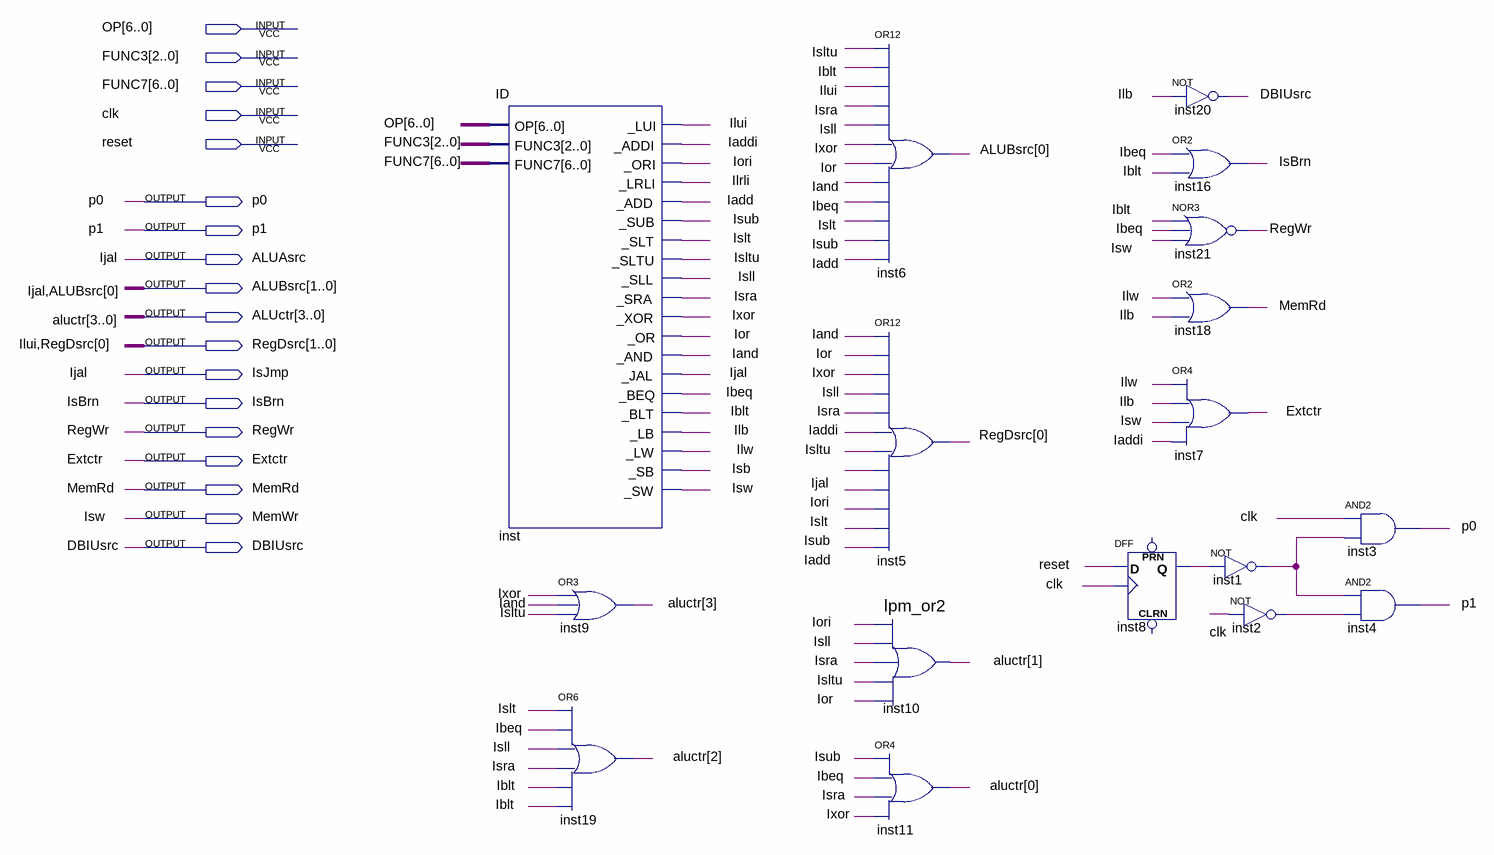
[diagram p0: schematic sheet]
// Quartus schematic CU.bdf as structural Verilog: 17 symbols, 18 pins
module CU (
  input  [6:0] OP,
  input  [2:0] FUNC3,
  input  [6:0] FUNC7,
  input  clk,
  input  reset,
  output p0,
  output p1,
  output ALUAsrc,
  output [1:0] ALUBsrc,
  output [3:0] ALUctr,
  output [1:0] RegDsrc,
  output IsJmp,
  output IsBrn,
  output RegWr,
  output Extctr,
  output MemRd,
  output MemWr,
  output DBIUsrc
);

  wire Iadd, Iaddi, Iand, Ibeq, Iblt, Ilb, Ilrli, Ilw, inst1_out, inst2_out, inst8_q, Ior, Iori, Isb, Isll,
       Islt, Isltu, Isra, Isub, Ixor;

  ID inst (
    .OP(OP), .FUNC3(FUNC3), .FUNC7(FUNC7), ._LUI(RegDsrc[1]), ._ADDI(Iaddi), ._ORI(Iori), ._LRLI(Ilrli),
    ._ADD(Iadd), ._SUB(Isub), ._SLT(Islt), ._SLTU(Isltu), ._SLL(Isll), ._SRA(Isra), ._XOR(Ixor), ._OR(Ior),
    ._AND(Iand), ._JAL(ALUAsrc), ._BEQ(Ibeq), ._BLT(Iblt), ._LB(Ilb), ._LW(Ilw), ._SB(Isb), ._SW(MemWr));
  or inst9 (ALUctr[3], Ixor, Iand, Isltu);
  or inst19 (ALUctr[2], Islt, Ibeq, Isll, Isra, Iblt, Iblt);
  or inst6 (ALUBsrc[0], Isltu, Iblt, RegDsrc[1], Isra, Isll, Ixor, Ior, Iand, Ibeq, Islt, Isub, Iadd);
  or inst5 (RegDsrc[0], Iand, Ior, Ixor, Isll, Isra, Iaddi, Isltu, ALUAsrc, Iori, Islt, Isub, Iadd);
  lpm_or2 inst10 (.data0(Iori), .data1(Isll), .data2(Isra), .data3(Isltu), .data4(Ior), .result(ALUctr[1]));
  or inst11 (ALUctr[0], Isub, Ibeq, Isra, Ixor);
  DFF inst8 (.CLK(clk), .D(reset), .Q(inst8_q));  // open: CLRN, PRN
  not inst20 (DBIUsrc, Ilb);
  or inst16 (IsBrn, Ibeq, Iblt);
  nor inst21 (RegWr, Iblt, Ibeq, MemWr);
  or inst18 (MemRd, Ilw, Ilb);
  or inst7 (Extctr, Ilw, Ilb, MemWr, Iaddi);
  not inst1 (inst1_out, inst8_q);
  not inst2 (inst2_out, clk);
  and inst3 (p0, clk, inst1_out);
  and inst4 (p1, inst1_out, inst2_out);

  assign ALUBsrc[1] = ALUAsrc;
  assign IsJmp = ALUAsrc;

  // Other names for the same wires on the sheet: Ijal = ALUAsrc; Ilui = RegDsrc[1]; Isw = MemWr
endmodule
